# EAGLE design logic-2ch (EAGLE 5.06)
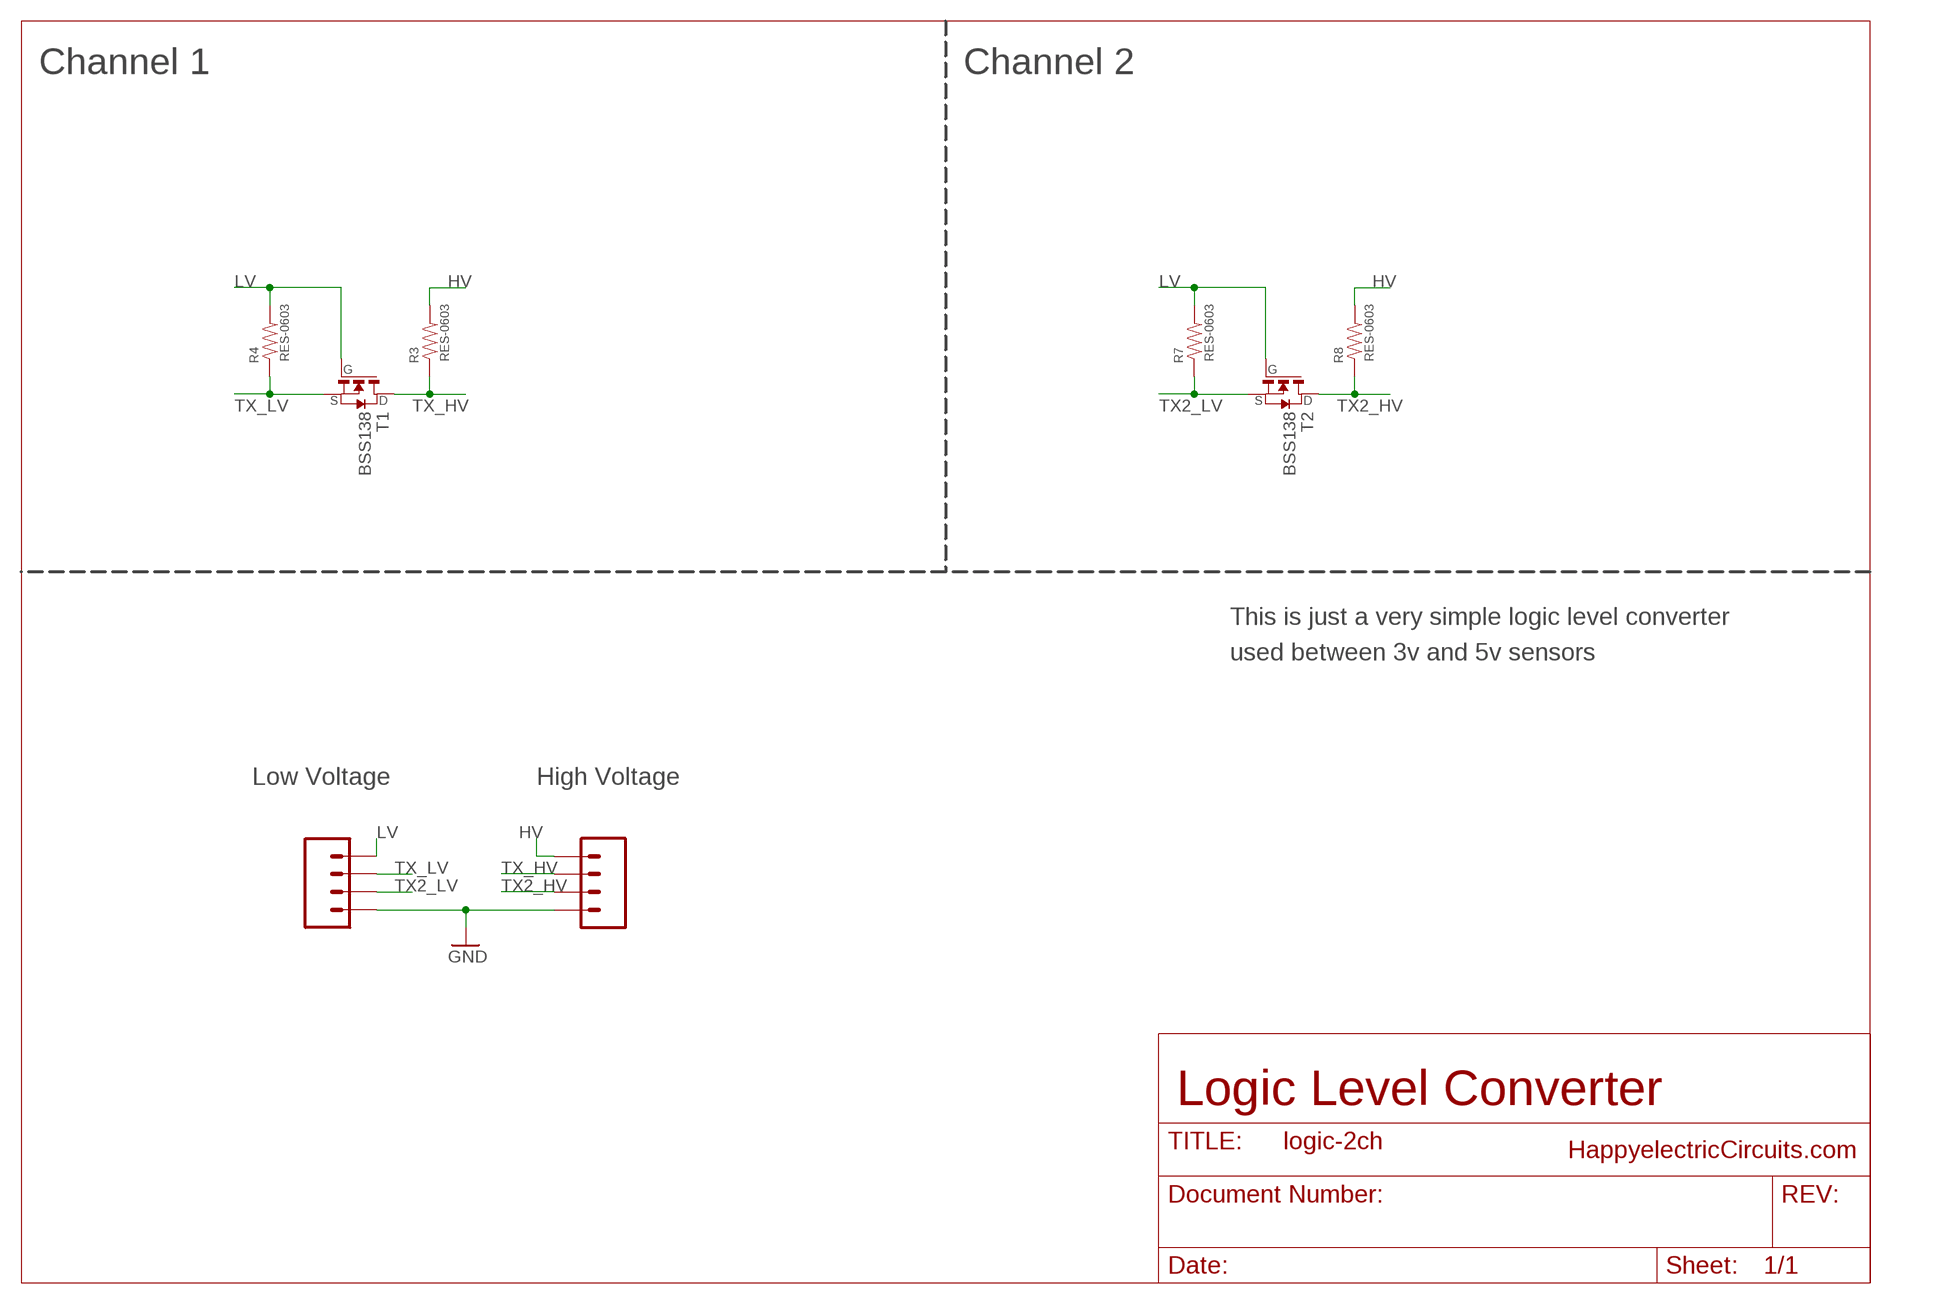
[diagram p0: schematic, sheet 1]

## Parts
JP1  LV1  M04  [M04]
JP2  LV2  M04  [M04]
R3  RES-0603  [0603-RES]
R4  RES-0603  [0603-RES]
R7  RES-0603  [0603-RES]
R8  RES-0603  [0603-RES]
T1  BSS138  [SOT-23]
T2  BSS138  [SOT-23]

## Nets
GND: JP1.1 JP2.1
HV: JP2.4 R3.1 R8.1
LV: JP1.4 R4.1 R7.1 T1.1(G) T2.1(G)
TX2_HV: JP2.2 R8.2 T2.3(D)
TX2_LV: JP1.2 R7.2 T2.2(S)
TX_HV: JP2.3 R3.2 T1.3(D)
TX_LV: JP1.3 R4.2 T1.2(S)

## Notes on the sheet
- Channel 1 | Channel 2
- This is just a very simple logic level converter
- used between 3v and 5v sensors
- Low Voltage | High Voltage
- Logic Level Converter
- HappyelectricCircuits.com

## Library data of the parts
JP1 JP2 = Travis:M04
R3 R4 R7 R8 = Travis:RES-0603
T1 T2 = Travis:BSS138

## Board
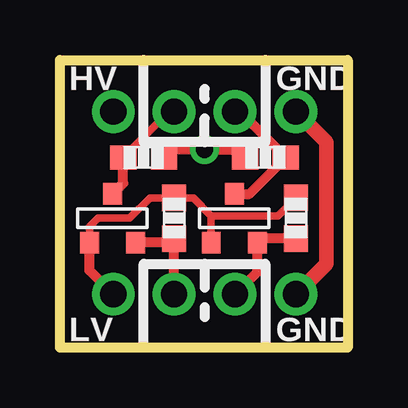
[diagram p1: board, top side]
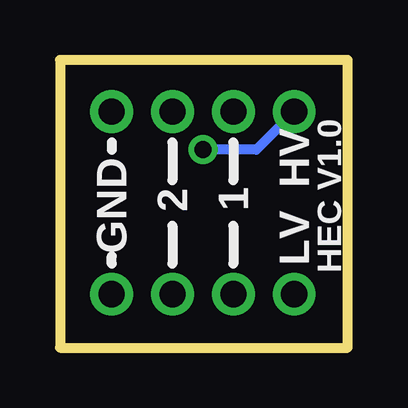
[diagram p2: board, bottom side, seen from below]

Size 12 x 12 mm. Coordinates in mm from the lower left corner, seen from the top.
Outline: 0,12 12,12 12,0 0,0 0,12
Copper layers (1*16): Top 0.035mm / dielectric 1.5mm / Bottom 0.035mm
Design rules "SparkFun *": minimum track width 8mil, minimum drill 20mil, track to track 8mil, track to pad 8mil, pad to pad 8mil, via to via 8mil, smd to smd 8mil, copper to edge 10mil, drill to drill 8mil, minimum pad ring 12mil, minimum via ring 10mil, stop-mask expansion 4mil, vias tented up to drill 28mil, thermal gap 10mil

### Footprints (pad centres in the part's own frame; a part is rotated, then mirrored left to right if it is on the bottom)
M04 = drill 1.1 pad 1.778 round: 1 0,0; 2 0,-2.54; 3 0,-5.08; 4 0,-7.62
0603-RES = smd 1.1 x 1: 1 -0.85,0; 2 0.85,0
SOT-23 = smd 0.787 x 0.889: 1 -0.991,-1.016; 2 0.94,-1.016; 3 -0.025,1.016

### Placement (x,y rotation side)
JP1  9.84,2.22 270 top
JP2  9.84,9.84 270 top
R3  3.49,7.94 180 top
R4  4.76,5.4 270 top
R7  9.84,5.4 270 top
R8  8.57,7.94 0 top
T1  2.22,5.4 0 top
T2  7.3,5.4 0 top

### Tracks (layer width: path | path; a pad name or v marks a point on that pad's centre or on a via)
GND
  Top 0.61: JP2.1 11.11,8.57 11.11,3.49 JP1.1
HV  (via drill 0.7)
  Top 0.406: R8.1 7.41,8.26 v6.03,8.26 4.66,8.26 R3.1
  Bottom 0.406: JP2.4 3.81,8.26 v6.03,8.26
LV
  Top 0.305: T1.1 1.23,5.04 1.59,5.4 2.9,5.4 3.75,6.25 R4.1 5.56,6.25 6.31,5.5 | 6.31,5.5 T2.1 | R7.1 9.1,5.5 6.31,5.5
  Top 0.406: JP1.4 1.23,3.21 T1.1
TX2_HV
  Top 0.305: R8.2 9.21,7.94
  Top 0.406: JP2.2 7.52,9.84 R8.2 7.9,6.41 T2.3
TX2_LV
  Top 0.305: T2.2 arc-90 8.41,4.55
  Top 0.406: R7.2 8.41,4.55 | JP1.2 8.24,3.16 T2.2
TX_HV
  Top 0.305: R3.2 4.55,9.84 JP2.3
  Top 0.406: T1.3 2.64,6.86 R3.2
TX_LV
  Top 0.305: R4.2 4.6,4.38
  Top 0.406: 4.6,4.38 T1.2 | JP1.3 R4.2

### Text on the board
bPlace: HEC V1.0 | GND | HV | 2 | LV | 1
tNames: HV | GND | LV | GND